# EAGLE schematic vca (EAGLE 6.5.0)
VCA
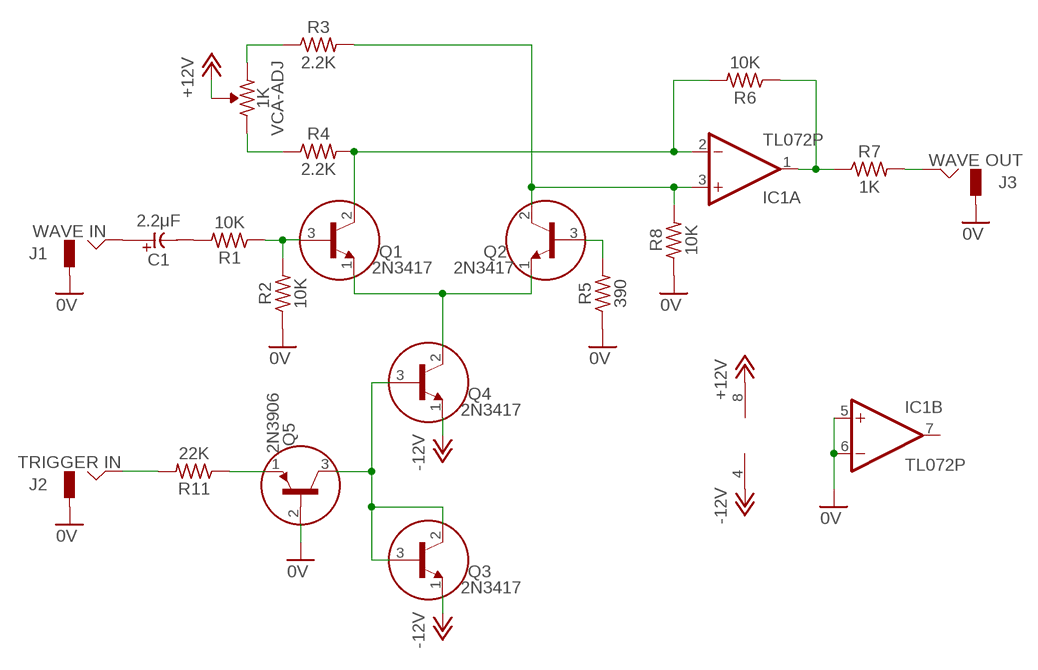
[diagram p0: schematic, sheet 1]

## Parts
C1  2.2μF  CE-USE2-5  [E2-5]
IC1  TL072P  [DIL08]
J1  WAVE IN  JACK-M  [JACK-M]
J2  TRIGGER IN  JACK-M  [JACK-M]
J3  WAVE OUT  JACK-M  [JACK-M]
Q1  2N3417  [TO92]
Q2  2N3417  [TO92]
Q3  2N3417  [TO92]
Q4  2N3417  [TO92]
Q5  2N3906  [TO92]
R1  10K  R0309/10  [0309/10]
R2  10K  R0309/10  [0309/10]
R3  2.2K  R0309/10  [0309/10]
R4  2.2K  R0309/10  [0309/10]
R5  390  R0309/10  [0309/10]
R6  10K  R0309/10  [0309/10]
R7  1K  R0309/10  [0309/10]
R8  10K  R0309/10  [0309/10]
R11  22K  R0309/10  [0309/10]
VCA-ADJ  1K  R-VAR  [R-VAR]

## Nets
0V: IC1.5(B:+IN) IC1.6(B:-IN) J1.GND J2.GND J3.GND Q5.2(B) R2.1 R5.1 R8.1
+12V: IC1.8(P:V+) VCA-ADJ.VAR
-12V: IC1.4(P:V-) Q3.1(E) Q4.1(E)
N$1: C1.+ J1.HOT
N$2: C1.- R1.2
N$3: J3.HOT R7.2
N$4: J2.HOT R11.2
N$5: Q1.3(B) R1.1 R2.2
N$6: R4.1 VCA-ADJ.R1
N$7: R3.1 VCA-ADJ.R2
N$8: IC1.3(A:+IN) Q2.2(C) R3.2 R8.2
N$9: IC1.2(A:-IN) Q1.2(C) R4.2 R6.2
N$10: Q2.3(B) R5.2
N$11: Q1.1(E) Q2.1(E) Q4.2(C)
N$12: Q5.1(E) R11.1
N$13: IC1.1(A:OUT) R6.1 R7.1
N$16: Q3.2(C) Q3.3(B) Q4.3(B) Q5.3(C)
Unconnected: IC1.7(B:OUT)

## Library data of the parts
C1 = _common:CE-US: ELECTROLYTIC CAPACITOR, US symbol
IC1 = _common:TL072: OP AMP
J1-J3 = _common:JACK-M
Q1-Q4 = _common:2N3417: NPN Transistor
Q5 = _common:2N3906: PNP Transistor
R1-R8 R11 = _common:R: RESISTOR, US symbol
VCA-ADJ = _common:R-VAR